# EAGLE schematic bot (EAGLE 9.3.0)
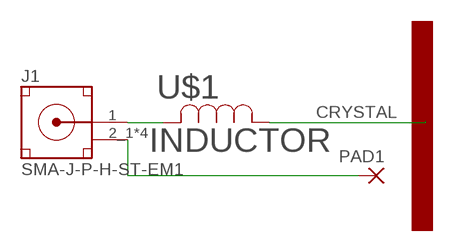
[diagram p0: schematic, sheet 1]

## Parts
J1  SMA-J-P-H-ST-EM1  [SMA-J-P-H-ST-EM1]
PAD1  2,54/0,8  [2,54/0,8]
U$1  INDUCTOR  [IND_7030]

## Nets
2L: J1.1(SIGNAL) U$1.2
CRYSTAL: U$1.1
GND: J1.2_1(GND) J1.2_2(GND) J1.3_1(GND) J1.3_2(GND) PAD1.1(P)

## Library data of the parts
J1 = SMA-J-P-H-ST-EM1:SMA-J-P-H-ST-EM1: Connector SMA F 50Ohm Solder ST Edge Mount Gold Over Nickel Tray; DESCRIPTION: Connector SMA F 50Ohm Solder ST Edge Mount Gold Over Nickel Tray; DIGI-KEY_PART_NUMBER: SAM8857-ND; DIGI-KEY_PURCHASE_URL: https://www.digikey.com/product-detail/en/samtec-inc/SMA-J-P-H-ST-EM1/SAM8857-ND/2602450?utm_source=snapeda&utm_medium=aggregator&utm_campaign=symbol; MF: Samtec; MP: SMA-J-P-H-ST-EM1; PACKAGE: None
PAD1 = wirepad:2,54/0,8: THROUGH-HOLE PAD
U$1 = new_inductor:INDUCTOR

## Module 1
Ports: 

### Library data of the parts